# EAGLE schematic VA-Meter-I2C (EAGLE 6.6.0)
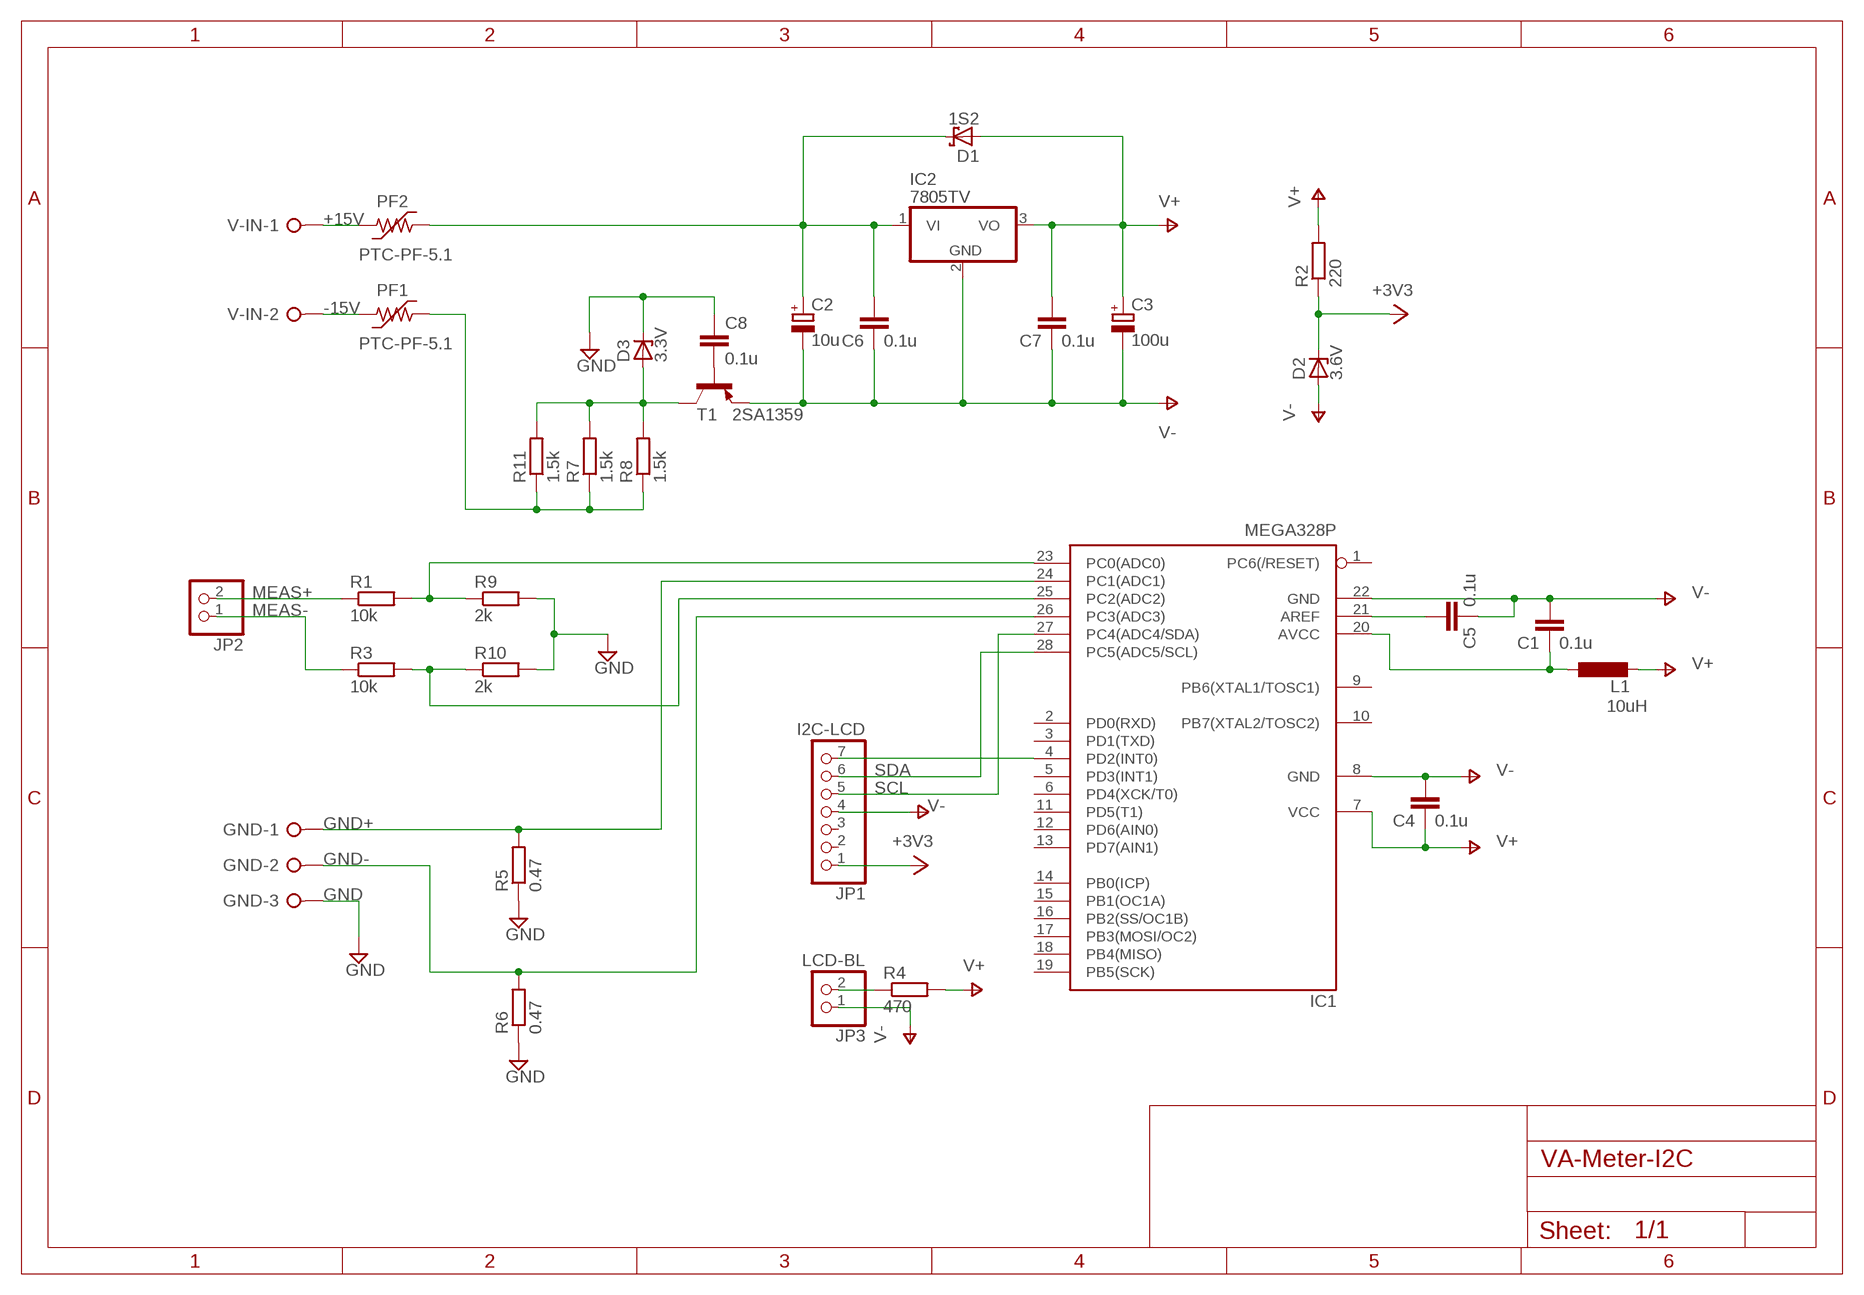
[diagram p0: schematic, sheet 1]

## Parts
C1  0.1u  C-EU050-024X044  [C050-024X044]
C2  10u  CPOL-EUE2.5-5  [E2,5-5]
C3  100u  CPOL-EUE2.5-6  [E2,5-6]
C4  0.1u  C-EU050-024X044  [C050-024X044]
C5  0.1u  C-EU050-024X044  [C050-024X044]
C6  0.1u  C-EU050-024X044  [C050-024X044]
C7  0.1u  C-EU050-024X044  [C050-024X044]
C8  0.1u  C-EU050-024X044  [C050-024X044]
D1  1S2  SCHOTTKY-DIODECB417-15  [CB417-15]
D2  3.6V  ZENER-DIODEZD-5  [ZDIO-5]
D3  3.3V  ZENER-DIODEZD-5  [ZDIO-5]
GND  W237-03P  [W237-133]
IC1  MEGA328P  [MEGA328P]
IC2  7805TV  [TO220V]
JP1  I2C-LCD  PINHD-1X7  [1X07]
JP2  PINHD-1X2  [1X02]
JP3  LCD-BL  PINHD-1X2  [1X02]
L1  10uH  L-EU6000-XXX-RC  [6000-XXXX-RC]
PF1  PTC-PF-5.1  [PF-5.1]
PF2  PTC-PF-5.1  [PF-5.1]
R1  10k  R-EU_0207/7  [0207/7]
R2  220  R-EU_0207/7  [0207/7]
R3  10k  R-EU_0207/7  [0207/7]
R4  470  R-EU_0207/7  [0207/7]
R5  0.47  R-EU_0613/15  [P0613/15]
R6  0.47  R-EU_0613/15  [P0613/15]
R7  1.5k  R-EU_0613/15  [P0613/15]
R8  1.5k  R-EU_0613/15  [P0613/15]
R9  2k  R-EU_0207/7  [0207/7]
R10  2k  R-EU_0207/7  [0207/7]
R11  1.5k  R-EU_0613/15  [P0613/15]
T1  2SA1359  -PNP-TO126V  [TO126V]
V-IN  W237-02P  [W237-132]

## Nets
+3V3: D2.C JP1.1 R2.1
+15V: C2.+ C6.2 D1.C IC2.1(VI) PF2.2
-15V: PF1.2 R7.1 R8.1 R11.1
GND: C8.1 D3.C GND.3 R5.1 R6.1 R9.2 R10.2
GND+: GND.1 IC1.24(PC1(ADC1)) R5.2
GND-: GND.2 IC1.26(PC3(ADC3)) R6.2
MEAS+: JP2.2 R1.1
MEAS-: JP2.1 R3.1
N$1: D3.A R7.2 R8.2 R11.2 T1.2(C)
N$2: JP3.2 R4.1
N$3: IC1.23(PC0(ADC0)) R1.2 R9.1
N$4: IC1.25(PC2(ADC2)) R3.2 R10.1
N$5: C8.2 T1.3(B)
N$6: PF2.1 V-IN.1
N$7: PF1.1 V-IN.2
N$9: C5.2 IC1.21(AREF)
N$10: C1.1 IC1.20(AVCC) L1.1
N$11: IC1.4(PD2(INT0)) JP1.7
SCL: IC1.27(PC4(ADC4/SDA)) JP1.5
SDA: IC1.28(PC5(ADC5/SCL)) JP1.6
V+: C3.+ C4.1 C7.2 D1.A IC1.7(VCC) IC2.3(VO) L1.2 R2.2 R4.2
V-: C1.2 C2.- C3.- C4.2 C5.1 C6.1 C7.1 D2.A IC1.8(GND) IC1.22(GND) IC2.2(GND) JP1.4 JP3.1 T1.1(E)
Unconnected: IC1.1(PC6(/RESET)) IC1.2(PD0(RXD)) IC1.3(PD1(TXD)) IC1.5(PD3(INT1)) IC1.6(PD4(XCK/T0)) IC1.9(PB6(XTAL1/TOSC1)) IC1.10(PB7(XTAL2/TOSC2)) IC1.11(PD5(T1)) IC1.12(PD6(AIN0)) IC1.13(PD7(AIN1)) IC1.14(PB0(ICP)) IC1.15(PB1(OC1A)) IC1.16(PB2(SS/OC1B)) IC1.17(PB3(MOSI/OC2)) IC1.18(PB4(MISO)) IC1.19(PB5(SCK)) JP1.2 JP1.3

## Library data of the parts
C1 C4-C8 = rcl:C-EU: CAPACITOR, European symbol
C2 C3 = rcl:CPOL-EU: POLARIZED CAPACITOR, European symbol
D1 = diode:SCHOTTKY-DIODE: Schottky Diode
D2 D3 = diode:ZENER-DIODE: Z-Diode
GND = con-wago-508:W237-03P: WAGO SREW CLAMP; OC_FARNELL: unknown; OC_NEWARK: unknown
IC1 = Mylib:MEGA328P: ATMega328P
IC2 = linear:78*: Positive VOLTAGE REGULATOR Source: http://cache.national.com/ds/LM/LM78L05.pdf http://www.fairchildsemi.com/ds/LM/LM7805.pdf
JP1 = pinhead:PINHD-1X7: PIN HEADER
JP2 JP3 = pinhead:PINHD-1X2: PIN HEADER
L1 = rcl:L-EU: INDUCTOR, European symbol
PF1 PF2 = polyswitch:PTC-: POLYSWITCH Polyswitch Resetable Fuses
R1-R11 = rcl:R-EU_: RESISTOR, European symbol
T1 = transistor:*-PNP-: PNP Transistror
V-IN = con-wago-508:W237-02P: WAGO SREW CLAMP; OC_FARNELL: unknown; OC_NEWARK: unknown